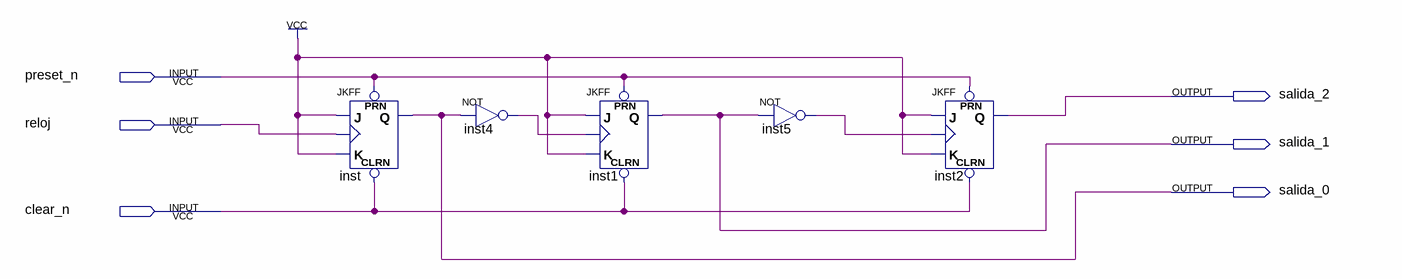
[diagram p0: schematic sheet]
// Quartus schematic CONTADOR.bdf as structural Verilog: 5 symbols, 6 pins
module CONTADOR (
  input  preset_n,
  input  reloj,
  input  clear_n,
  output salida_2,
  output salida_1,
  output salida_0
);

  wire inst4_out, inst5_out;

  JKFF inst (.PRN(preset_n), .CLRN(clear_n), .K(1'b1), .J(1'b1), .CLK(reloj), .Q(salida_0));
  not inst4 (inst4_out, salida_0);
  JKFF inst1 (.PRN(preset_n), .CLRN(clear_n), .K(1'b1), .J(1'b1), .CLK(inst4_out), .Q(salida_1));
  not inst5 (inst5_out, salida_1);
  JKFF inst2 (.PRN(preset_n), .CLRN(clear_n), .K(1'b1), .J(1'b1), .CLK(inst5_out), .Q(salida_2));
endmodule
